# Altium schematic sheet PMS.SchDoc
size C
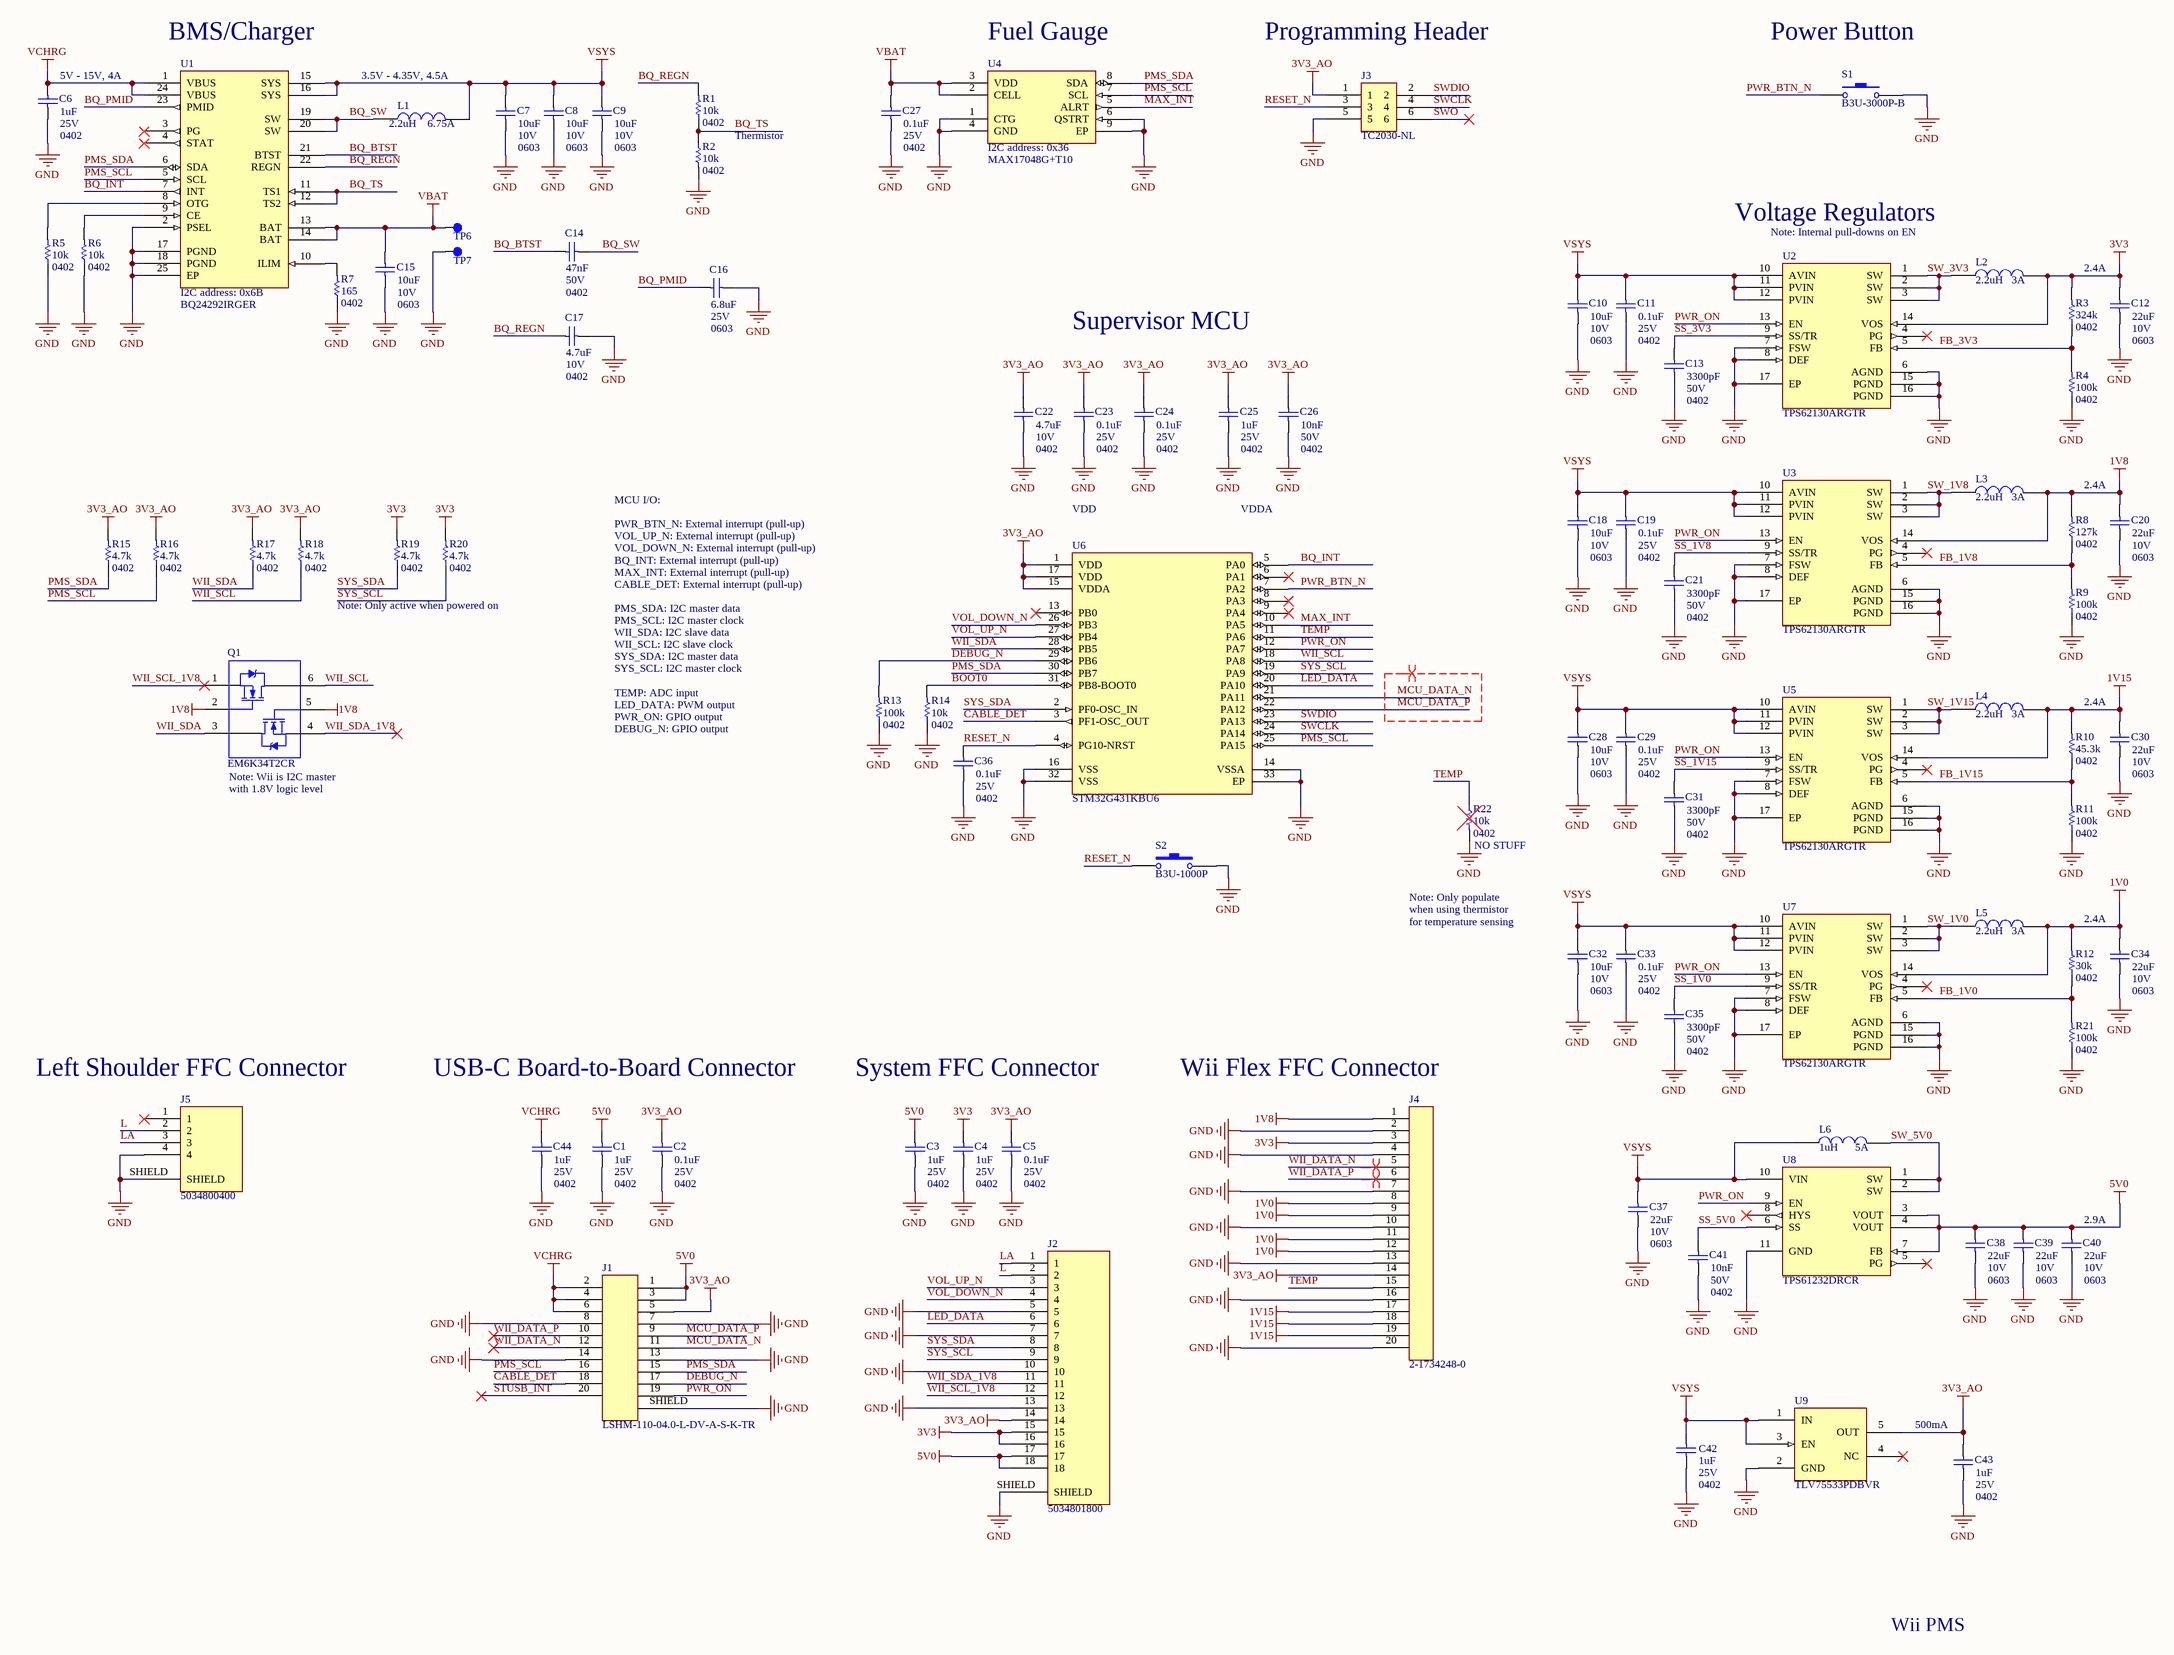
[diagram p0: PMS.SchDoc]

## Parts
C1  value 1uF  Rated Voltage: 25V  Package: 0402  [CAPC1005X06N]  (hidden comment: Capacitor)
C2  value 0.1uF  Rated Voltage: 25V  Package: 0402  [CAPC1005X06N]  (hidden comment: Capacitor)
C3  value 1uF  Rated Voltage: 25V  Package: 0402  [CAPC1005X06N]  (hidden comment: Capacitor)
C4  value 1uF  Rated Voltage: 25V  Package: 0402  [CAPC1005X06N]  (hidden comment: Capacitor)
C5  value 0.1uF  Rated Voltage: 25V  Package: 0402  [CAPC1005X06N]  (hidden comment: Capacitor)
C6  value 1uF  Rated Voltage: 25V  Package: 0402  [CAPC1005X06N]  (hidden comment: Capacitor)
C7  value 10uF  Rated Voltage: 10V  Package: 0603  [CAPC1608X09N]  (hidden comment: Capacitor)
C8  value 10uF  Rated Voltage: 10V  Package: 0603  [CAPC1608X09N]  (hidden comment: Capacitor)
C9  value 10uF  Rated Voltage: 10V  Package: 0603  [CAPC1608X09N]  (hidden comment: Capacitor)
C10  value 10uF  Rated Voltage: 10V  Package: 0603  [CAPC1608X09N]  (hidden comment: Capacitor)
C11  value 0.1uF  Rated Voltage: 25V  Package: 0402  [CAPC1005X06N]  (hidden comment: Capacitor)
C12  value 22uF  Rated Voltage: 10V  Package: 0603  [CAPC1608X09N]  (hidden comment: Capacitor)
C13  value 3300pF  Rated Voltage: 50V  Package: 0402  [CAPC1005X06N]  (hidden comment: Capacitor)
C14  value 47nF  Rated Voltage: 50V  Package: 0402  [CAPC1005X06N]  (hidden comment: Capacitor)
C15  value 10uF  Rated Voltage: 10V  Package: 0603  [CAPC1608X09N]  (hidden comment: Capacitor)
C16  value 6.8uF  Rated Voltage: 25V  Package: 0603  [CAPC1608X09N]  (hidden comment: Capacitor)
C17  value 4.7uF  Rated Voltage: 10V  Package: 0402  [CAPC1005X06N]  (hidden comment: Capacitor)
C18  value 10uF  Rated Voltage: 10V  Package: 0603  [CAPC1608X09N]  (hidden comment: Capacitor)
C19  value 0.1uF  Rated Voltage: 25V  Package: 0402  [CAPC1005X06N]  (hidden comment: Capacitor)
C20  value 22uF  Rated Voltage: 10V  Package: 0603  [CAPC1608X09N]  (hidden comment: Capacitor)
C21  value 3300pF  Rated Voltage: 50V  Package: 0402  [CAPC1005X06N]  (hidden comment: Capacitor)
C22  value 4.7uF  Rated Voltage: 10V  Package: 0402  [CAPC1005X06N]  (hidden comment: Capacitor)
C23  value 0.1uF  Rated Voltage: 25V  Package: 0402  [CAPC1005X06N]  (hidden comment: Capacitor)
C24  value 0.1uF  Rated Voltage: 25V  Package: 0402  [CAPC1005X06N]  (hidden comment: Capacitor)
C25  value 1uF  Rated Voltage: 25V  Package: 0402  [CAPC1005X06N]  (hidden comment: Capacitor)
C26  value 10nF  Rated Voltage: 50V  Package: 0402  [CAPC1005X06N]  (hidden comment: Capacitor)
C27  value 0.1uF  Rated Voltage: 25V  Package: 0402  [CAPC1005X06N]  (hidden comment: Capacitor)
C28  value 10uF  Rated Voltage: 10V  Package: 0603  [CAPC1608X09N]  (hidden comment: Capacitor)
C29  value 0.1uF  Rated Voltage: 25V  Package: 0402  [CAPC1005X06N]  (hidden comment: Capacitor)
C30  value 22uF  Rated Voltage: 10V  Package: 0603  [CAPC1608X09N]  (hidden comment: Capacitor)
C31  value 3300pF  Rated Voltage: 50V  Package: 0402  [CAPC1005X06N]  (hidden comment: Capacitor)
C32  value 10uF  Rated Voltage: 10V  Package: 0603  [CAPC1608X09N]  (hidden comment: Capacitor)
C33  value 0.1uF  Rated Voltage: 25V  Package: 0402  [CAPC1005X06N]  (hidden comment: Capacitor)
C34  value 22uF  Rated Voltage: 10V  Package: 0603  [CAPC1608X09N]  (hidden comment: Capacitor)
C35  value 3300pF  Rated Voltage: 50V  Package: 0402  [CAPC1005X06N]  (hidden comment: Capacitor)
C36  value 0.1uF  Rated Voltage: 25V  Package: 0402  [CAPC1005X06N]  (hidden comment: Capacitor)
C37  value 22uF  Rated Voltage: 10V  Package: 0603  [CAPC1608X09N]  (hidden comment: Capacitor)
C38  value 22uF  Rated Voltage: 10V  Package: 0603  [CAPC1608X09N]  (hidden comment: Capacitor)
C39  value 22uF  Rated Voltage: 10V  Package: 0603  [CAPC1608X09N]  (hidden comment: Capacitor)
C40  value 22uF  Rated Voltage: 10V  Package: 0603  [CAPC1608X09N]  (hidden comment: Capacitor)
C41  value 10nF  Rated Voltage: 50V  Package: 0402  [CAPC1005X06N]  (hidden comment: Capacitor)
C42  value 1uF  Rated Voltage: 25V  Package: 0402  [CAPC1005X06N]  (hidden comment: Capacitor)
C43  value 1uF  Rated Voltage: 25V  Package: 0402  [CAPC1005X06N]  (hidden comment: Capacitor)
C44  value 1uF  Rated Voltage: 25V  Package: 0402  [CAPC1005X06N]  (hidden comment: Capacitor)
J1  LSHM-110-04.0-L-DV-A-S-K-TR  [LSHM-110-04.0-L-DV-A-S]
J2  5034801800  [5034801800]
J3  TC2030-NL  [TC2030-NL]
J4  2-1734248-0  [2-1734248-0]
J5  5034800400  [5034800400]
L1  Current Rating: 6.75A  Inductance: 2.2uH  [INDM5252X30N]  (hidden comment: IHLP2020CZER2R2M11)
L2  Current Rating: 3A  Inductance: 2.2uH  [INDM3030X20N]  (hidden comment: IHLP1212BZER2R2M11)
L3  Current Rating: 3A  Inductance: 2.2uH  [INDM3030X20N]  (hidden comment: IHLP1212BZER2R2M11)
L4  Current Rating: 3A  Inductance: 2.2uH  [INDM3030X20N]  (hidden comment: IHLP1212BZER2R2M11)
L5  Current Rating: 3A  Inductance: 2.2uH  [INDM3030X20N]  (hidden comment: IHLP1212BZER2R2M11)
L6  Inductance: 1uH  Current Rating: 5A  [INDM3030X20N]  (hidden comment: IHLP1212BZER1R0M11)
Q1  EM6K34T2CR  [SOTFL50P160X50-6N]
R1  value 10k  Package: 0402  [RESC1005X04N]  (hidden comment: Resistor)
R2  value 10k  Package: 0402  [RESC1005X04N]  (hidden comment: Resistor)
R3  value 324k  Package: 0402  [RESC1005X04N]  (hidden comment: Resistor)
R4  value 100k  Package: 0402  [RESC1005X04N]  (hidden comment: Resistor)
R5  value 10k  Package: 0402  [RESC1005X04N]  (hidden comment: Resistor)
R6  value 10k  Package: 0402  [RESC1005X04N]  (hidden comment: Resistor)
R7  value 165  Package: 0402  [RESC1005X04N]  (hidden comment: Resistor)
R8  value 127k  Package: 0402  [RESC1005X04N]  (hidden comment: Resistor)
R9  value 100k  Package: 0402  [RESC1005X04N]  (hidden comment: Resistor)
R10  value 45.3k  Package: 0402  [RESC1005X04N]  (hidden comment: Resistor)
R11  value 100k  Package: 0402  [RESC1005X04N]  (hidden comment: Resistor)
R12  value 30k  Package: 0402  [RESC1005X04N]  (hidden comment: Resistor)
R13  value 100k  Package: 0402  [RESC1005X04N]  (hidden comment: Resistor)
R14  value 10k  Package: 0402  [RESC1005X04N]  (hidden comment: Resistor)
R15  value 4.7k  Package: 0402  [RESC1005X04N]  (hidden comment: Resistor)
R16  value 4.7k  Package: 0402  [RESC1005X04N]  (hidden comment: Resistor)
R17  value 4.7k  Package: 0402  [RESC1005X04N]  (hidden comment: Resistor)
R18  value 4.7k  Package: 0402  [RESC1005X04N]  (hidden comment: Resistor)
R19  value 4.7k  Package: 0402  [RESC1005X04N]  (hidden comment: Resistor)
R20  value 4.7k  Package: 0402  [RESC1005X04N]  (hidden comment: Resistor)
R21  value 100k  Package: 0402  [RESC1005X04N]  (hidden comment: Resistor)
R22  value 10k  Package: 0402  Note: NO STUFF  [RESC1005X04N]  (hidden comment: Resistor)
S1  B3U-3000P-B  [B3U-3000P-B]
S2  B3U-1000P  [B3U-1000P]
TP6  Test Point  [TP_RECTANGULAR_1.5X2MM]  (value not drawn)
TP7  Test Point  [TP_RECTANGULAR_1.5X2MM]  (value not drawn)
U1  BQ24292IRGER  [QFN50P400X400X100_HS-25N]
U2  TPS62130ARGTR  [QFN50P300X300X100_HS-17N]
U3  TPS62130ARGTR  [QFN50P300X300X100_HS-17N]
U4  MAX17048G+T10  [SON50P200X80_HS-9N]
U5  TPS62130ARGTR  [QFN50P300X300X100_HS-17N]
U6  STM32G431KBU6  [QFN50P500X500X60_HS-33N]
U7  TPS62130ARGTR  [QFN50P300X300X100_HS-17N]
U8  TPS61232DRCR  [SON50P300X100_HS-11N]
U9  TLV75533PDBVR  [SOT95P280X145-5N]

## Nets
1V0: C34.2 J4.8 J4.9 J4.11 J4.12 L5.2 R12.2 U7.14(VOS)
1V8: C20.2 J4.1 L3.2 Q1.2(G1) Q1.5(G2) R8.2 U3.14(VOS)
1V15: C30.2 J4.17 J4.18 J4.19 L4.2 R10.2 U5.14(VOS)
3V3: C4.2 C12.2 J2.15 J2.16 J4.3 L2.2 R3.2 R19.2 R20.2 U2.14(VOS)
3V3_AO: C2.2 C5.2 C22.2 C23.2 C24.2 C25.2 C26.2 C43.2 J1.5 J2.14 J3.1 J4.14 R15.2 R16.2 R17.2 R18.2 U6.1(VDD) U6.15(VDDA) U6.17(VDD) U9.5(OUT)
5V0: C1.2 C3.2 C38.2 C39.2 C40.2 J1.1 J1.3 J2.17 J2.18 U8.3(VOUT) U8.4(VOUT) U8.7(FB)
GND: C1.1 C2.1 C3.1 C4.1 C5.1 C6.1 C7.1 C8.1 C9.1 C10.1 C11.1 C12.1 C13.1 C15.1 C16.2 C17.2 C18.1 C19.1 C20.1 C21.1 C22.1 C23.1 C24.1 C25.1 C26.1 C27.1 C28.1 C29.1 C30.1 C31.1 C32.1 C33.1 C34.1 C35.1 C36.1 C37.1 C38.1 C39.1 C40.1 C41.1 C42.1 C43.1 C44.1 J1.7 J1.8 J1.13 J1.14 J1.SHIELD J2.5 J2.7 J2.10 J2.13 J2.SHIELD J3.5 J4.2 J4.4 J4.7 J4.10 J4.13 J4.16 J4.20 J5.4 J5.SHIELD R2.2 R4.1 R5.1 R6.1 R7.1 R9.1 R11.1 R13.1 R14.1 R21.1 R22.2 S1.1 S2.2 TP7.1 U1.2(PSEL) U1.17(PGND) U1.18(PGND) U1.25(EP) U2.6(AGND) U2.7(FSW) U2.8(DEF) U2.15(PGND) U2.16(PGND) U2.17(EP) U3.6(AGND) U3.7(FSW) U3.8(DEF) U3.15(PGND) U3.16(PGND) U3.17(EP) U4.1(CTG) U4.4(GND) U4.6(QSTRT) U4.9(EP) U5.6(AGND) U5.7(FSW) U5.8(DEF) U5.15(PGND) U5.16(PGND) U5.17(EP) U6.14(VSSA) U6.16(VSS) U6.32(VSS) U6.33(EP) U7.6(AGND) U7.7(FSW) U7.8(DEF) U7.15(PGND) U7.16(PGND) U7.17(EP) U8.11(GND) U9.2(GND)
VBAT: C15.2 C27.2 TP6.1 U1.13(BAT) U1.14(BAT) U4.2(CELL) U4.3(VDD)
VCHRG: C6.2 C44.2 J1.2 J1.4 J1.6 U1.1(VBUS) U1.24(VBUS)
VSYS: C7.2 C8.2 C9.2 C10.2 C11.2 C18.2 C19.2 C28.2 C29.2 C32.2 C33.2 C37.2 C42.2 L1.2 L6.1 U1.15(SYS) U1.16(SYS) U2.10(AVIN) U2.11(PVIN) U2.12(PVIN) U3.10(AVIN) U3.11(PVIN) U3.12(PVIN) U5.10(AVIN) U5.11(PVIN) U5.12(PVIN) U7.10(AVIN) U7.11(PVIN) U7.12(PVIN) U8.10(VIN) U9.1(IN) U9.3(EN)
BOOT0: R14.2 U6.31(PB8-BOOT0)
BQ_BTST: C14.1 U1.21(BTST)
BQ_INT: U1.7(INT) U6.5(PA0)
BQ_PMID: C16.1 U1.23(PMID)
BQ_REGN: C17.1 R1.2 U1.22(REGN)
BQ_SW: C14.2 L1.1 U1.19(SW) U1.20(SW)
BQ_TS: R1.1 R2.1 U1.11(TS1) U1.12(TS2)
CABLE_DET: J1.18 U6.3(PF1-OSC_OUT)
DEBUG_N: J1.17 R13.2 U6.29(PB6)
FB_1V0: R12.1 R21.2 U7.5(FB)
FB_1V8: R8.1 R9.2 U3.5(FB)
FB_1V15: R10.1 R11.2 U5.5(FB)
FB_3V3: R3.1 R4.2 U2.5(FB)
L: J2.2 J5.2
LA: J2.1 J5.3
LED_DATA: J2.6 U6.20(PA10)
MAX_INT: U4.5(ALRT) U6.10(PA5)
MCU_DATA_N: J1.11 U6.21(PA11)
MCU_DATA_P: J1.9 U6.22(PA12)
PMS_SCL: J1.16 R16.1 U1.5(SCL) U4.7(SCL) U6.25(PA15)
PMS_SDA: J1.15 R15.1 U1.6(SDA) U4.8(SDA) U6.30(PB7)
PWR_BTN_N: S1.2 U6.7(PA2)
PWR_ON: J1.19 U2.13(EN) U3.13(EN) U5.13(EN) U6.12(PA7) U7.13(EN) U8.9(EN)
RESET_N: C36.2 J3.3 S2.1 U6.4(PG10-NRST)
SS_1V0: C35.2 U7.9(SS/TR)
SS_1V8: C21.2 U3.9(SS/TR)
SS_1V15: C31.2 U5.9(SS/TR)
SS_3V3: C13.2 U2.9(SS/TR)
SS_5V0: C41.2 U8.6(SS)
STUSB_INT: J1.20
SW_1V0: L5.1 U7.1(SW) U7.2(SW) U7.3(SW)
SW_1V8: L3.1 U3.1(SW) U3.2(SW) U3.3(SW)
SW_1V15: L4.1 U5.1(SW) U5.2(SW) U5.3(SW)
SW_3V3: L2.1 U2.1(SW) U2.2(SW) U2.3(SW)
SW_5V0: L6.2 U8.1(SW) U8.2(SW)
SWCLK: J3.4 U6.24(PA14)
SWDIO: J3.2 U6.23(PA13)
SWO: J3.6
SYS_SCL: J2.9 R20.1 U6.19(PA9)
SYS_SDA: J2.8 R19.1 U6.2(PF0-OSC_IN)
TEMP: J4.15 R22.1 U6.11(PA6)
VOL_DOWN_N: J2.4 U6.26(PB3)
VOL_UP_N: J2.3 U6.27(PB4)
WII_DATA_N: J1.12 J4.5
WII_DATA_P: J1.10 J4.6
WII_SCL: Q1.6(D1) R18.1 U6.18(PA8)
WII_SCL_1V8: J2.12 Q1.1(S1)
WII_SDA: Q1.3(D2) R17.1 U6.28(PB5)
WII_SDA_1V8: J2.11 Q1.4(S2)
NetR5_2: R5.2 U1.8(OTG)
NetR6_2: R6.2 U1.9(CE)
NetR7_2: R7.2 U1.10(ILIM)

Not connected (* = marked no-connect by the designer): J5 1*; U1 3(PG)* 4(STAT)*; U2 4(PG)*; U3 4(PG)*; U5 4(PG)*; U6 6(PA1)* 8(PA3)* 9(PA4)* 13(PB0)*; U7 4(PG)*; U8 5(PG)* 8(HYS)*; U9 4(NC)*

## Layout directives
differential pair: MCU_DATA_N, MCU_DATA_P, WII_DATA_N, WII_DATA_P

## Notes on the sheet
- (near C6) 5V - 15V, 4A
- (near U1) BMS/Charger
- 3.5V - 4.35V, 4.5A
- (near U4) Fuel Gauge
- Programming Header
- Power Button
- Thermistor
- Voltage Regulators
- Note: Internal pull-downs on EN
- 2.4A
- Supervisor MCU
- VDD
- VDDA
- Note: Only active when powered on
- MCU I/O:
  PWR_BTN_N: External interrupt (pull-up)
  VOL_UP_N: External interrupt (pull-up)
  VOL_DOWN_N: External interrupt (pull-up)
  BQ_INT: External interrupt (pull-up)
  MAX_INT: External interrupt (pull-up)
  CABLE_DET: External interrupt (pull-up)
  PMS_SDA: I2C master data
  PMS_SCL: I2C master clock
  WII_SDA: I2C slave data
  WII_SCL: I2C slave clock
  SYS_SDA: I2C master data
  SYS_SCL: I2C master clock
  TEMP: ADC input
  LED_DATA: PWM output
  PWR_ON: GPIO output
  DEBUG_N: GPIO output
- (near Q1) Note: Wii is I2C master with 1.8V logic level
- Note: Only populate when using thermistor for temperature sensing
- (near J5) Left Shoulder FFC Connector
- USB-C Board-to-Board Connector
- System FFC Connector
- (near J4) Wii Flex FFC Connector
- (near C40) 2.9A
- 500mA
- Wii PMS
- (in symbol BQ24292IRGER) I2C address: 0x6B
- (in symbol MAX17048G+T10) I2C address: 0x36

## Library data of the parts
C1-C44 = Capacitor: General purpose capacitor
J1 = LSHM-110-04.0-L-DV-A-S-K-TR: HERMAPHRODITIC 0.50MM SMD 20POS 4MM; Manufacturer: Samtec; Supplier 1: Digi-Key; Manufacturer Part Number: LSHM-110-04.0-L-DV-A-S-K-TR; RoHS: No; Pricing 1: 625=3.77400 (USD)
J2 = 5034801800: CONN FFC FPC 18POS 0.50MM R/A; Manufacturer: Molex; Actuator Material: Nylon,Glass,Polyamide; Number of Positions: 18; Max Voltage Rating (AC): 50V; Current Rating: 500mA; Mating Cycles: 10; Stackable: No; Contact Location: Dual; Gender: Receptacle; Wire/Cable Type: Straight; Pitch: 0.5mm; Supplier 1: Digi-Key; Manufacturer Part Number: 5034801800; RoHS: Yes; Category: FFC / FPC; Stock 1: 15433; Pricing 1: 1=1.44000, 10=1.31000, 25=1.23000, 50=1.17660, 100=1.12310, 250=1.01616, 500=0.93594, 1000=0.80223 (USD); Housing Material: Polymer; Contact Material: Bronze,Gold; Housing Color: White; Contact Plating: Gold,Tin; Material: Bronze; Min Operating Temperature: -40°C; Max Operating Temperature: 85°C; Packaging: Tape and Reel; Termination: SMD/SMT; Number of Contacts: 18; Orientation: Right Angle; Number of Rows: 1; Package Quantity: 3000; Voltage Rating: 50V; Number of Circuits: 18; Voltage Rating (AC): 50V; Length: 10.7mm; Depth: 4mm; Radiation Hardening: No; Flammability Rating: UL94 V-0; REACH SVHC: Unknown; Halogen Free: Low Halogen; ELV: Compliant; ComponentLink1URL: https://datasheet.ciiva.com/671/5034800400-sd-671136.pdf?src-supplier=Digi-Key; ComponentLink1Description: https://datasheet.ciiva.com/671/5034800400-sd-671136.pdf?src-supplier=Digi-Key; ComponentLink2URL: https://datasheet.ciiva.com/5137/5034801800-ffc-fpc-connectors-179548-5137672.pdf?src-supplier=Mouser; ComponentLink2Description: https://datasheet.ciiva.com/5137/5034801800-ffc-fpc-connectors-179548-5137672.pdf?src-supplier=Mouser; ComponentLink3URL: https://datasheet.ciiva.com/10366/5034801800-ffc-fpc-connectors-10366583.pdf?src-supplier=Avnet; ComponentLink3Description: https://datasheet.ciiva.com/10366/5034801800-ffc-fpc-connectors-10366583.pdf?src-supplier=Avnet
J3 = TC2030-NL: 6-Pin No-Legs Tag-Connect Plug-of-Nails™ Cable with Ribbon Connector
J4 = 2-1734248-0: FFC/FPC CONNECTOR, RECEPTACLE 20POS 1ROW; Manufacturer: TE Connectivity; Number of Contacts: 20; Contact Current Rating: 1A; Contact Location: Bottom; Connector Type: Receptacle,Connector,Socket; Wire/Cable Type: Flat Flex; Connector System: Flex-to-Board; Mating Alignment: Yes (With); PCB Mount Alignment: No (Without); PCB Mount Retention: With; PCB Mounting Orientation: Vertical; Gender: Male; Voltage Rating: 125V; Shielding: Unshielded; Pitch: 0.039inch; Supplier 1: Digi-Key; Manufacturer Part Number: 2-1734248-0; RoHS: Yes; Category: FFC / FPC; Stock 1: 651; Pricing 1: 1=1.62000, 10=1.47400, 25=1.38360, 50=1.32340, 100=1.26330, 250=1.14300, 500=1.05274 (USD); Mount: Surface Mount; Housing Color: Black; Housing Material: Thermoplastic; Contact Plating: Gold; Contact Material: Bronze; Min Operating Temperature: -4°C; Max Operating Temperature: 185°C; Termination: SMD/SMT; Orientation: Straight; Number of Rows: 1; Number of Positions: 20; Sealable: No (Without); Shrouded: Yes (With); Current Rating: 1A; Package Quantity: 1000; Packaging: Tape and Reel; Length: 27.4mm; Height: 7.7mm; Depth: 4.6mm; Width: 4.6mm; Radiation Hardening: No; REACH SVHC: Unknown; Flammability Rating: UL94 V-0; ELV: Compliant; Lead Free: Lead Free; ComponentLink1URL: https://datasheet.ciiva.com/1446/1652249-1446928.pdf?src-supplier=Farnell; ComponentLink1Description: https://datasheet.ciiva.com/1446/1652249-1446928.pdf?src-supplier=Farnell; ComponentLink2URL: https://datasheet.ciiva.com/43513/eng-ds-1-1773440-6-0506-43513462.pdf?src-supplier=Onlinecomponents.com; ComponentLink2Description: https://datasheet.ciiva.com/43513/eng-ds-1-1773440-6-0506-43513462.pdf?src-supplier=Onlinecomponents.com; ComponentLink3URL: https://datasheet.ciiva.com/669/eng-cd-1734248-e1-669771.pdf?src-supplier=Digi-Key; ComponentLink3Description: https://datasheet.ciiva.com/669/eng-cd-1734248-e1-669771.pdf?src-supplier=Digi-Key; ComponentLink4URL: https://datasheet.ciiva.com/669/eng-cd-1734248-e1-669772.pdf?src-supplier=Digi-Key; ComponentLink4Description: https://datasheet.ciiva.com/669/eng-cd-1734248-e1-669772.pdf?src-supplier=Digi-Key; ComponentLink5URL: https://datasheet.ciiva.com/669/eng-cd-1734248-e1-669773.pdf?src-supplier=Digi-Key; ComponentLink5Description: https://datasheet.ciiva.com/669/eng-cd-1734248-e1-669773.pdf?src-supplier=Digi-Key; ComponentLink6URL: https://datasheet.ciiva.com/1437/586796-1437710.pdf?src-supplier=Element14; ComponentLink6Description: https://datasheet.ciiva.com/1437/586796-1437710.pdf?src-supplier=Element14
J5 = 5034800400: CONN FFC FPC 4POS 0.50MM R/A; Manufacturer: Molex; Actuator Material: Nylon,Glass,Polyamide; Current Rating: 500mA; Voltage Rating: 50V; Wire/Cable Type: Straight; Number of Positions: 4; Mating Cycles: 10; Stackable: No; Gender: Female; Pitch: 0.5mm; Supplier 1: Digi-Key; Manufacturer Part Number: 5034800400; RoHS: Yes; Category: FFC / FPC; Stock 1: 13432; Pricing 1: 1=0.70000, 10=0.65200, 25=0.58640, 50=0.52140, 100=0.49970, 250=0.45624, 500=0.43450, 1000=0.35846 (USD); Contact Material: Bronze; Contact Plating: Gold; Housing Color: White; Housing Material: Polymer; Material: Bronze; Min Operating Temperature: -40°C; Max Operating Temperature: 85°C; Number of Rows: 1; Orientation: Right Angle; Termination: Solder; Package Quantity: 1; Packaging: Tape and Reel; Max Voltage Rating (AC): 50V; Number of Contacts: 4; Max Voltage Rating (DC): 50V; Number of Circuits: 4; Voltage Rating (AC): 50V; Length: 3.7mm; Depth: 4mm; Radiation Hardening: No; Flammability Rating: UL94 V-0; REACH SVHC: No SVHC; Halogen Free: Low Halogen; ELV: Compliant; ComponentLink1URL: https://datasheet.ciiva.com/671/5034800400-sd-671136.pdf?src-supplier=Digi-Key; ComponentLink1Description: https://datasheet.ciiva.com/671/5034800400-sd-671136.pdf?src-supplier=Digi-Key; ComponentLink2URL: https://datasheet.ciiva.com/15249/392825034800400-ffc-fpc-nectors-15249120.pdf?src-supplier=Arrow+Europe; ComponentLink2Description: https://datasheet.ciiva.com/15249/392825034800400-ffc-fpc-nectors-15249120.pdf?src-supplier=Arrow+Europe; ComponentLink3URL: https://datasheet.ciiva.com/16658/5034800400-ffc-fpc-connectors-16658883.pdf?src-supplier=Avnet+Europe; ComponentLink3Description: https://datasheet.ciiva.com/16658/5034800400-ffc-fpc-connectors-16658883.pdf?src-supplier=Avnet+Europe; ComponentLink4URL: https://datasheet.ciiva.com/3926/135095034800400-ffc-fpc-nectors-3926214.pdf?src-supplier=Arrow; ComponentLink4Description: https://datasheet.ciiva.com/3926/135095034800400-ffc-fpc-nectors-3926214.pdf?src-supplier=Arrow; ComponentLink5URL: https://datasheet.ciiva.com/5137/5034800400-ffc-fpc-connectors-179546-5137607.pdf?src-supplier=Mouser; ComponentLink5Description: https://datasheet.ciiva.com/5137/5034800400-ffc-fpc-connectors-179546-5137607.pdf?src-supplier=Mouser; ComponentLink6URL: https://datasheet.ciiva.com/671/5034800400-sd-671137.pdf?src-supplier=Digi-Key; ComponentLink6Description: https://datasheet.ciiva.com/671/5034800400-sd-671137.pdf?src-supplier=Digi-Key; ComponentLink7URL: https://datasheet.ciiva.com/671/5034800400-sd-671138.pdf?src-supplier=Digi-Key; ComponentLink7Description: https://datasheet.ciiva.com/671/5034800400-sd-671138.pdf?src-supplier=Digi-Key; ComponentLink8URL: https://datasheet.ciiva.com/10366/5034800400-ffc-fpc-connectors-10366566.pdf?src-supplier=Avnet; ComponentLink8Description: https://datasheet.ciiva.com/10366/5034800400-ffc-fpc-connectors-10366566.pdf?src-supplier=Avnet
L1 = IHLP2020CZER2R2M11: FIXED IND 2.2UH 6.75A 25 MOHM; Manufacturer: Vishay Dale; Core Material: Metal,Composite; Tolerance: 20%; DC Resistance (DCR): 25mR; Saturation Current: 5.5A; Shielding: Shielded; Self Resonant Frequency: 41MHz; Test Frequency: 100kHz; Supplier 1: Digi-Key; Manufacturer Part Number: IHLP2020CZER2R2M11; RoHS: Yes; Category: Fixed Inductors; Stock 1: 58349; Pricing 1: 1=2.39000, 10=2.20800, 100=1.54560, 500=1.25120, 1000=1.14080 (USD); Mount: Surface Mount; Case/Package: 2020; Contact Plating: Tin; Min Operating Temperature: -55°C; Max Operating Temperature: 125°C; Packaging: Tape and Reel; Inductance Tolerance: 20%; Package Quantity: 2000; Max DC Current: 5.5A; Termination: SMD/SMT; RMS Current (Irms): 6.75A; Military Standard: Not; Length: 5.74mm; Height: 3mm; Depth: 5.43mm; Width: 0.204inch; Height - Seated (Max): 0.118inch; Radiation Hardening: No; Lead Free: Lead Free; REACH SVHC: Unknown; ComponentLink1URL: https://datasheet.ciiva.com/11798/0900766b8102c930-11798352.pdf?src-supplier=RSComponents; ComponentLink1Description: https://datasheet.ciiva.com/11798/0900766b8102c930-11798352.pdf?src-supplier=RSComponents; ComponentLink2URL: https://datasheet.ciiva.com/1051/lp20cz11-1051642.pdf?src-supplier=Digi-Key; ComponentLink2Description: https://datasheet.ciiva.com/1051/lp20cz11-1051642.pdf?src-supplier=Digi-Key; ComponentLink3URL: https://datasheet.ciiva.com/1051/lp20cz11-1051643.pdf?src-supplier=Digi-Key; ComponentLink3Description: https://datasheet.ciiva.com/1051/lp20cz11-1051643.pdf?src-supplier=Digi-Key; ComponentLink4URL: https://datasheet.ciiva.com/17269/lp20cz11-17269547.pdf?src-supplier=Avnet+Europe; ComponentLink4Description: https://datasheet.ciiva.com/17269/lp20cz11-17269547.pdf?src-supplier=Avnet+Europe; ComponentLink5URL: https://datasheet.ciiva.com/1051/lp20cz11-1051644.pdf?src-supplier=Digi-Key; ComponentLink5Description: https://datasheet.ciiva.com/1051/lp20cz11-1051644.pdf?src-supplier=Digi-Key; ComponentLink6URL: https://datasheet.ciiva.com/24205/lp20cz11-24205966.pdf?src-supplier=Future+Electronics; ComponentLink6Description: https://datasheet.ciiva.com/24205/lp20cz11-24205966.pdf?src-supplier=Future+Electronics; ComponentLink7URL: https://datasheet.ciiva.com/46385/480942-46385615.pdf?src-supplier=Element14; ComponentLink7Description: https://datasheet.ciiva.com/46385/480942-46385615.pdf?src-supplier=Element14
L2-L5 = IHLP1212BZER2R2M11: FIXED IND 2.2UH 3A 46 MOHM SMD; Manufacturer: Vishay Dale; Core Material: Metal,Composite,Ferrite; Tolerance: 20%; DC Resistance (DCR): 46mR; Self Resonant Frequency: 55MHz; Shielding: Shielded; Saturation Current: 3.3A; Test Frequency: 100kHz; Supplier 1: Digi-Key; Manufacturer Part Number: IHLP1212BZER2R2M11; RoHS: Yes; Category: Fixed Inductors; Stock 1: 1430; Pricing 1: 1=1.45000, 10=1.34600, 100=0.97290, 500=0.74520, 1000=0.66240 (USD); Mount: Surface Mount; Case/Package: 1212; Number of Pins: 2; Contact Plating: Tin; Min Operating Temperature: -55°C; Max Operating Temperature: 125°C; Packaging: Tape and Reel; Inductance Tolerance: 20%; Package Quantity: 3000; Max DC Current: 3A; Termination: SMD/SMT; RMS Current (Irms): 3A; Military Standard: Not; Length: 3.6mm; Height: 2mm; Depth: 3.2mm; Width: 3mm; Height - Seated (Max): 0.079inch; Radiation Hardening: No; REACH SVHC: Unknown; Lead Free: Lead Free; ComponentLink1URL: https://datasheet.ciiva.com/7290/1537140-7290128.pdf?src-supplier=Newark; ComponentLink1Description: https://datasheet.ciiva.com/7290/1537140-7290128.pdf?src-supplier=Newark; ComponentLink2URL: https://datasheet.ciiva.com/8017/1520470-8017625.pdf?src-supplier=Element14; ComponentLink2Description: https://datasheet.ciiva.com/8017/1520470-8017625.pdf?src-supplier=Element14; ComponentLink3URL: https://datasheet.ciiva.com/11798/0900766b8102b422-11798283.pdf?src-supplier=RSComponents; ComponentLink3Description: https://datasheet.ciiva.com/11798/0900766b8102b422-11798283.pdf?src-supplier=RSComponents; ComponentLink4URL: https://datasheet.ciiva.com/3866/lp12bz11-3866206.pdf?src-supplier=Arrow; ComponentLink4Description: https://datasheet.ciiva.com/3866/lp12bz11-3866206.pdf?src-supplier=Arrow; ComponentLink5URL: https://datasheet.ciiva.com/16335/lp12bz11-16335797.pdf?src-supplier=Future+Electronics; ComponentLink5Description: https://datasheet.ciiva.com/16335/lp12bz11-16335797.pdf?src-supplier=Future+Electronics; ComponentLink6URL: https://datasheet.ciiva.com/4953/lp12bz11-244380-4953990.pdf?src-supplier=Mouser; ComponentLink6Description: https://datasheet.ciiva.com/4953/lp12bz11-244380-4953990.pdf?src-supplier=Mouser; ComponentLink7URL: https://datasheet.ciiva.com/6688/lp12bz11-6688247.pdf?src-supplier=Digi-Key; ComponentLink7Description: https://datasheet.ciiva.com/6688/lp12bz11-6688247.pdf?src-supplier=Digi-Key; ComponentLink8URL: https://datasheet.ciiva.com/6688/lp12bz11-6688250.pdf?src-supplier=Digi-Key; ComponentLink8Description: https://datasheet.ciiva.com/6688/lp12bz11-6688250.pdf?src-supplier=Digi-Key; ComponentLink9URL: https://datasheet.ciiva.com/6688/lp12bz11-6688252.pdf?src-supplier=Digi-Key; ComponentLink9Description: https://datasheet.ciiva.com/6688/lp12bz11-6688252.pdf?src-supplier=Digi-Key; ComponentLink10URL: https://datasheet.ciiva.com/3081/lp12bz11-3081917.pdf?src-supplier=Avnet; ComponentLink10Description: https://datasheet.ciiva.com/3081/lp12bz11-3081917.pdf?src-supplier=Avnet; ComponentLink11URL: https://datasheet.ciiva.com/17268/lp12bz11-17268765.pdf?src-supplier=Avnet+Europe; ComponentLink11Description: https://datasheet.ciiva.com/17268/lp12bz11-17268765.pdf?src-supplier=Avnet+Europe
L6 = IHLP1212BZER1R0M11: FIXED IND 1UH 5A 24 MOHM SMD; Manufacturer: Vishay Dale; Core Material: Metal,Composite; Tolerance: 20%; DC Resistance (DCR): 24mR; Self Resonant Frequency: 75MHz; Shielding: Shielded; Saturation Current: 4.5A; Test Frequency: 100kHz; Supplier 1: Digi-Key; Manufacturer Part Number: IHLP1212BZER1R0M11; RoHS: Yes; Category: Fixed Inductors; Stock 1: 94740; Pricing 1: 1=1.45000, 10=1.34600, 100=0.97290, 500=0.74520, 1000=0.66240 (USD); Mount: Surface Mount; Case/Package: 1212; Number of Pins: 2; Case Code (Imperial): 1212; Contact Plating: Tin; Case Code (Metric): 3630; Min Operating Temperature: -55°C; Max Operating Temperature: 125°C; Packaging: Tape and Reel; Package Quantity: 3000; Inductance Tolerance: 20%; Max DC Current: 5A; Termination: SMD/SMT; RMS Current (Irms): 5A; Military Standard: Not; Length: 3.6mm; Height: 2mm; Depth: 3.2mm; Width: 0.118inch; Height - Seated (Max): 0.079inch; Radiation Hardening: No; REACH SVHC: Unknown; Lead Free: Lead Free; ComponentLink1URL: https://datasheet.ciiva.com/11798/0900766b8102b422-11798284.pdf?src-supplier=RSComponents; ComponentLink1Description: https://datasheet.ciiva.com/11798/0900766b8102b422-11798284.pdf?src-supplier=RSComponents; ComponentLink2URL: https://datasheet.ciiva.com/26821/getdatasheetpartid-180380-26821417.pdf?src-supplier=Verical; ComponentLink2Description: https://datasheet.ciiva.com/26821/getdatasheetpartid-180380-26821417.pdf?src-supplier=Verical; ComponentLink3URL: https://datasheet.ciiva.com/6688/lp12bz11-6688261.pdf?src-supplier=Digi-Key; ComponentLink3Description: https://datasheet.ciiva.com/6688/lp12bz11-6688261.pdf?src-supplier=Digi-Key; ComponentLink4URL: https://datasheet.ciiva.com/6688/lp12bz11-6688263.pdf?src-supplier=Digi-Key; ComponentLink4Description: https://datasheet.ciiva.com/6688/lp12bz11-6688263.pdf?src-supplier=Digi-Key; ComponentLink5URL: https://datasheet.ciiva.com/8017/652599-8017624.pdf?src-supplier=Element14; ComponentLink5Description: https://datasheet.ciiva.com/8017/652599-8017624.pdf?src-supplier=Element14; ComponentLink6URL: https://datasheet.ciiva.com/17268/lp12bz11-17268761.pdf?src-supplier=Avnet+Europe; ComponentLink6Description: https://datasheet.ciiva.com/17268/lp12bz11-17268761.pdf?src-supplier=Avnet+Europe; ComponentLink7URL: https://datasheet.ciiva.com/6688/lp12bz11-6688255.pdf?src-supplier=Digi-Key; ComponentLink7Description: https://datasheet.ciiva.com/6688/lp12bz11-6688255.pdf?src-supplier=Digi-Key; ComponentLink8URL: https://datasheet.ciiva.com/4957/lp12bz11-244380-4957957.pdf?src-supplier=Mouser; ComponentLink8Description: https://datasheet.ciiva.com/4957/lp12bz11-244380-4957957.pdf?src-supplier=Mouser; ComponentLink9URL: https://datasheet.ciiva.com/3081/lp12bz11-3081912.pdf?src-supplier=Avnet; ComponentLink9Description: https://datasheet.ciiva.com/3081/lp12bz11-3081912.pdf?src-supplier=Avnet
Q1 = EM6K34T2CR: MOSFET 2N-CH 50V 0.2A EMT6; Manufacturer: Rohm; FET Type: 2 N-Channel; Continuous Drain Current (ID): 200mA; Rds On Max: 2.2R; Input Capacitance: 26pF; Max Power Dissipation: 120mW; Supplier 1: Digi-Key; Manufacturer Part Number: EM6K34T2CR; RoHS: Yes; Category: MOSFETs; Stock 1: 17851; Pricing 1: 1=0.35000, 10=0.26400, 25=0.23120, 100=0.12540, 250=0.12476, 500=0.10230, 1000=0.07590, 2500=0.06666 (USD); Mount: Surface Mount; Packaging: Tape and Reel; Drain to Source Voltage (Vdss): 50V; Lead Free: Lead Free; ComponentLink1URL: http://www.mouser.com/ds/2/348/em6k34-515126.pdf?src-supplier=Mouser; ComponentLink1Description: http://www.mouser.com/ds/2/348/em6k34-515126.pdf?src-supplier=Mouser; ComponentLink2URL: http://www.farnell.com/datasheets/2197909.pdf?src-supplier=Farnell; ComponentLink2Description: http://www.farnell.com/datasheets/2197909.pdf?src-supplier=Farnell; ComponentLink3URL: http://rohmfs.rohm.com/en/products/databook/datasheet/discrete/transistor/mosfet/em6k34.pdf?src-supplier=Digi-Key; ComponentLink3Description: http://rohmfs.rohm.com/en/products/databook/datasheet/discrete/transistor/mosfet/em6k34.pdf?src-supplier=Digi-Key; ComponentLink4URL: http://rohmfs.rohm.com/en/products/databook/datasheet/discrete/transistor/mosfet/em6k34.pdf?src-supplier=Avnet; ComponentLink4Description: http://rohmfs.rohm.com/en/products/databook/datasheet/discrete/transistor/mosfet/em6k34.pdf?src-supplier=Avnet; ComponentLink5URL: http://rohmfs.rohm.com/en/techdata_basic/transistor/taping/EMT6_T2R_taping.pdf?src-supplier=Digi-Key; ComponentLink5Description: http://rohmfs.rohm.com/en/techdata_basic/transistor/taping/EMT6_T2R_taping.pdf?src-supplier=Digi-Key; ComponentLink6URL: http://www.farnell.com/datasheets/2197909.pdf?src-supplier=Newark; ComponentLink6Description: http://www.farnell.com/datasheets/2197909.pdf?src-supplier=Newark
R1-R22 = Resistor: General purpose resistor
S1 = B3U-3000P-B: Switch Tactile N.O. SPST Button Gull Wing 0.05A 12VDC 1.59N SMD Embossed T/R; Manufacturer: Omron; Mechanical Life: 100000Cycles; Illumination Type: Non-Illuminated,Illuminated; Insulation Resistance: 100MR; Contact Current Rating: 50mA; Voltage Rating (DC): 12V; Switch Travel: 0.2mm; Switch Function: Off-Mom; Actuator Length: 0.7mm; Ratings: Dust Proof; Supplier 1: Digi-Key; Manufacturer Part Number: B3U-3000P-B; RoHS: Yes; Category: Tactile Switches; Stock 1: 25144; Pricing 1: 1=0.98000, 10=0.94300, 25=0.88120, 100=0.76500, 250=0.69612, 500=0.64536, 1000=0.59822 (USD); Mount: Surface Mount; Weight: 0.000776oz; Min Operating Temperature: -25°C; Max Operating Temperature: 70°C; Termination: SMD/SMT; Electrical Life: 100000Cycles; Max Current Rating: 50mA; Operating Force: 1.59N; Packaging: Tape and Reel; Throw Configuration: SPST; Contact Resistance: 100mR; Package Quantity: 1; Current Rating: 50mA; Max Voltage Rating (DC): 12V; Orientation: Right Angle; Length: 4mm; Height: 1.2mm; Depth: 3.2mm; Width: 3mm; Radiation Hardening: No; REACH SVHC: No SVHC; Lead Free: Lead Free; ComponentLink1URL: https://datasheet.ciiva.com/26945/getdatasheetpartid-788439-26945782.pdf?src-supplier=Verical; ComponentLink1Description: https://datasheet.ciiva.com/26945/getdatasheetpartid-788439-26945782.pdf?src-supplier=Verical; ComponentLink2URL: https://datasheet.ciiva.com/1634/60838-1634401.pdf?src-supplier=Farnell; ComponentLink2Description: https://datasheet.ciiva.com/1634/60838-1634401.pdf?src-supplier=Farnell; ComponentLink3URL: https://datasheet.ciiva.com/16861/70176037-16861125.pdf?src-supplier=Allied+Electronics; ComponentLink3Description: https://datasheet.ciiva.com/16861/70176037-16861125.pdf?src-supplier=Allied+Electronics; ComponentLink4URL: https://datasheet.ciiva.com/2900/b3u-1110-2900041.pdf?src-supplier=Digi-Key; ComponentLink4Description: https://datasheet.ciiva.com/2900/b3u-1110-2900041.pdf?src-supplier=Digi-Key; ComponentLink5URL: https://datasheet.ciiva.com/2900/b3u-1110-2900042.pdf?src-supplier=Digi-Key; ComponentLink5Description: https://datasheet.ciiva.com/2900/b3u-1110-2900042.pdf?src-supplier=Digi-Key; ComponentLink6URL: https://datasheet.ciiva.com/1532/60838-1532683.pdf?src-supplier=Element14; ComponentLink6Description: https://datasheet.ciiva.com/1532/60838-1532683.pdf?src-supplier=Element14; ComponentLink7URL: https://datasheet.ciiva.com/22696/60838-22696215.pdf?src-supplier=Element14; ComponentLink7Description: https://datasheet.ciiva.com/22696/60838-22696215.pdf?src-supplier=Element14; ComponentLink8URL: https://datasheet.ciiva.com/2900/b3u-1110-2900043.pdf?src-supplier=Digi-Key; ComponentLink8Description: https://datasheet.ciiva.com/2900/b3u-1110-2900043.pdf?src-supplier=Digi-Key; ComponentLink9URL: https://datasheet.ciiva.com/30119/en-b3u-30119821.pdf?src-supplier=Onlinecomponents.com; ComponentLink9Description: https://datasheet.ciiva.com/30119/en-b3u-30119821.pdf?src-supplier=Onlinecomponents.com
S2 = B3U-1000P: OMRON ELECTRONIC COMPONENTS         B3U-1000P            SWITCH, SPST-NO, 0.05A, 12V, SMD; Mechanical Life: 200000Cycles; Operating Force: 1.5N; Throw Configuration: SPST; Current Rating: 50mA; Contact Resistance: 100mR; Illumination Type: Non-Illuminated,Illuminated; Switch Travel: 0.15mm; Switch Function: Off-Mom; Actuator Type: Standard; Actuator Length: 0.4mm; Ratings: Dust Proof,IP40; Supplier 1: Digi-Key; Manufacturer: Omron; Manufacturer Part Number: B3U-1000P; Stock 1: 38234; Pricing 1: 1=0.84000, 10=0.80700, 25=0.76080, 50=0.66960, 100=0.60880, 250=0.57836, 500=0.56312, 1000=0.44137 (USD); RoHS: Yes; Mount: Surface Mount; Weight: 0.000776oz; Contact Material: Silver; Min Operating Temperature: -25°C; Max Operating Temperature: 70°C; Packaging: Tape and Reel; Voltage Rating (DC): 12V; Package Quantity: 1; Max Current Rating: 50mA; Termination: SMD/SMT; Orientation: Straight; Max Voltage Rating (DC): 12V; Electrical Life: 200000Cycles; Insulation Resistance: 100MR; Contact Current Rating: 50mA; Length: 4mm; Height: 1.2mm; Depth: 2.5mm; Width: 3mm; REACH SVHC: Unknown; Lead Free: Lead Free; ComponentLink1URL: https://datasheet.ciiva.com/26917/getdatasheetpartid-552554-26917552.pdf?src-supplier=Verical; ComponentLink1Description: https://datasheet.ciiva.com/26917/getdatasheetpartid-552554-26917552.pdf?src-supplier=Verical; ComponentLink2URL: https://datasheet.ciiva.com/22696/1685550-22696214.pdf?src-supplier=Element14; ComponentLink2Description: https://datasheet.ciiva.com/22696/1685550-22696214.pdf?src-supplier=Element14; ComponentLink3URL: https://datasheet.ciiva.com/1532/1685550-1532680.pdf?src-supplier=Element14; ComponentLink3Description: https://datasheet.ciiva.com/1532/1685550-1532680.pdf?src-supplier=Element14; ComponentLink4URL: https://datasheet.ciiva.com/1634/1685550-1634396.pdf?src-supplier=Farnell; ComponentLink4Description: https://datasheet.ciiva.com/1634/1685550-1634396.pdf?src-supplier=Farnell; ComponentLink5URL: https://datasheet.ciiva.com/14142/b3u-eng-datasheet-14142540.pdf?src-supplier=Distrelec; ComponentLink5Description: https://datasheet.ciiva.com/14142/b3u-eng-datasheet-14142540.pdf?src-supplier=Distrelec; ComponentLink6URL: https://datasheet.ciiva.com/2900/b3u-1110-2900029.pdf?src-supplier=Digi-Key; ComponentLink6Description: https://datasheet.ciiva.com/2900/b3u-1110-2900029.pdf?src-supplier=Digi-Key; ComponentLink7URL: https://datasheet.ciiva.com/16155/en-b3u-16155021.pdf?src-supplier=Onlinecomponents.com; ComponentLink7Description: https://datasheet.ciiva.com/16155/en-b3u-16155021.pdf?src-supplier=Onlinecomponents.com; ComponentLink8URL: https://datasheet.ciiva.com/2900/b3u-1110-2900030.pdf?src-supplier=Digi-Key; ComponentLink8Description: https://datasheet.ciiva.com/2900/b3u-1110-2900030.pdf?src-supplier=Digi-Key; ComponentLink9URL: https://datasheet.ciiva.com/16862/70176037-16862846.pdf?src-supplier=Allied+Electronics; ComponentLink9Description: https://datasheet.ciiva.com/16862/70176037-16862846.pdf?src-supplier=Allied+Electronics; ComponentLink10URL: https://datasheet.ciiva.com/2900/b3u-1110-2900031.pdf?src-supplier=Digi-Key; ComponentLink10Description: https://datasheet.ciiva.com/2900/b3u-1110-2900031.pdf?src-supplier=Digi-Key
TP6 TP7 = Test Point: General purpose test point
U1 = BQ24292IRGER: IC LI+ CHARGER PWR MGMT 24VQFN; Manufacturer: Texas Instruments; Interface: I2C; Min Supply Voltage: 3.9V; Max Supply Voltage: 17V; Output Current: 4.5A; Output Voltage: 4.4V; Switching Frequency: 1.5MHz; Number of Cells: 1; Operating Supply Current: 3A; Fault Protection: Over Current,Over Voltage,Over Temperature; Supplier 1: Digi-Key; Manufacturer Part Number: BQ24292IRGER; RoHS: Yes; Category: Battery Management; Stock 1: 2820; Pricing 1: 1=5.71000, 10=5.13100, 25=4.85120, 100=3.98860, 250=3.57896, 500=3.44960, 1000=2.86748 (USD); Mount: Surface Mount; Case/Package: VQFN; Number of Pins: 24; Contact Plating: Gold; Min Operating Temperature: -40°C; Max Operating Temperature: 85°C; Package Quantity: 3000; Packaging: Tape and Reel; Max Charge Current: 4.5A; Battery Pack Voltage: 4.4V; Lead Free: Lead Free; ComponentLink1URL: https://datasheet.ciiva.com/18617/bq24292i-18617578.pdf?src-supplier=Digi-Key; ComponentLink1Description: https://datasheet.ciiva.com/18617/bq24292i-18617578.pdf?src-supplier=Digi-Key
U2 U3 U5 U7 = TPS62130ARGTR: Conv DC-DC Single Step Down 3V to 17V 16-Pin QFN T/R; Manufacturer: Texas Instruments; Output Voltage: 6V; Output Current: 3A; Quiescent Current: 17uA; Output Type: Adjustable; Output Configuration: Positive; Number of Outputs: 1; Switching Frequency: 2.5MHz; Synchronous Rectifier: Yes; Min Output Voltage: 900mV; Supplier 1: Digi-Key; Manufacturer Part Number: TPS62130ARGTR; RoHS: Yes; Category: Power Supply Modules; Stock 1: 19781; Pricing 1: 1=2.08000, 10=1.86600, 25=1.76000, 100=1.40800, 250=1.23200, 500=1.19680, 1000=0.95040 (USD); Mount: Surface Mount; Case/Package: QFN; Number of Pins: 16; Contact Plating: Gold; Min Operating Temperature: -40°C; Max Operating Temperature: 125°C; Operating Supply Voltage: 17V; Package Quantity: 3000; Packaging: Tape and Reel; Max Input Voltage: 17V; Min Input Voltage: 3V; Min Supply Voltage: 3V; Max Output Current: 3A; Max Output Voltage: 6V; Radiation Hardening: No; Lead Free: Lead Free; REACH SVHC: No SVHC; ComponentLink1URL: https://datasheet.ciiva.com/14377/tps62130-14377120.pdf?src-supplier=Digi-Key; ComponentLink1Description: https://datasheet.ciiva.com/14377/tps62130-14377120.pdf?src-supplier=Digi-Key; ComponentLink2URL: https://datasheet.ciiva.com/46638/tps62130a-46638750.pdf?src-supplier=Digi-Key; ComponentLink2Description: https://datasheet.ciiva.com/46638/tps62130a-46638750.pdf?src-supplier=Digi-Key; ComponentLink3URL: https://datasheet.ciiva.com/30031/tps62130-30031567.pdf?src-supplier=Avnet; ComponentLink3Description: https://datasheet.ciiva.com/30031/tps62130-30031567.pdf?src-supplier=Avnet
U4 = MAX17048G+T10: IC FUEL GAUGE LI-ION 1CELL 8TDFN; Manufacturer: Maxim; Operating Supply Current: 23uA; Output Voltage: 400mV; Operating Supply Voltage: 4.5V; Supplier 1: Digi-Key; Manufacturer Part Number: MAX17048G+T10; RoHS: Yes; Category: Battery Management; Stock 1: 3057; Pricing 1: 1=2.14000, 10=1.92300, 25=1.81800, 100=1.49480, 250=1.34128, 500=1.31300 (USD); Mount: Surface Mount; Number of Pins: 8; Contact Plating: Tin,Matte; Min Operating Temperature: -20°C; Max Operating Temperature: 85°C; Packaging: Tape and Reel; Package Quantity: 10000; Radiation Hardening: No; ComponentLink1URL: https://datasheet.ciiva.com/14083/max17048-max17049-14083973.pdf?src-supplier=Digi-Key; ComponentLink1Description: https://datasheet.ciiva.com/14083/max17048-max17049-14083973.pdf?src-supplier=Digi-Key
U6 = STM32G431KBU6: MCU 32-Bit ARM Cortex-M4 RISC 128KB Flash 1.71V to 3.6V 32-Pin UFQFPN; Manufacturer: STMicroelectronics; Supplier 1: Digi-Key; Manufacturer Part Number: STM32G431KBU6; RoHS: No; Stock 1: 2759; Pricing 1: 1=4.44000, 10=3.99100, 25=3.77320, 100=3.27000, 250=3.10228, 500=2.78366, 1000=2.34766, 2500=2.23028, 5000=2.14643 (USD)
U8 = TPS61232DRCR: IC REG BOOST 5V 4A 10VSON; Manufacturer: Texas Instruments; Output Type: Fixed; Number of Outputs: 1; Switching Frequency: 2MHz; Min Input Voltage: 2.3V; Efficiency: 96%; Max Output Current: 2.1A; Max Input Voltage: 5.5V; Quiescent Current: 35uA; Supplier 1: Digi-Key; Manufacturer Part Number: TPS61232DRCR; RoHS: Yes; Category: Power Supply Modules; Stock 1: 1050; Pricing 1: 1=2.47000, 10=2.21500, 25=2.09000, 100=1.67200, 250=1.46300, 500=1.42120, 1000=1.12860 (USD); Mount: Surface Mount; Number of Pins: 10; Contact Plating: Gold; Min Operating Temperature: -40°C; Max Operating Temperature: 85°C; Output Voltage: 5V; Topology: Boost; Operating Supply Voltage: 5.5V; Lead Free: Lead Free; ComponentLink1URL: http://www.ti.com/lit/ds/symlink/tps61232.pdf?src-supplier=Digi-Key; ComponentLink1Description: http://www.ti.com/lit/ds/symlink/tps61232.pdf?src-supplier=Digi-Key; ComponentLink2URL: http://www.ti.com/general/docs/suppproductinfo.tsp?distId=10&amp;gotoUrl=http%3A%2F%2Fwww.ti.com%2Flit%2Fgpn%2Ftps61232&src-supplier=Digi-Key; ComponentLink2Description: http://www.ti.com/general/docs/suppproductinfo.tsp?distId=10&amp;gotoUrl=http%3A%2F%2Fwww.ti.com%2Flit%2Fgpn%2Ftps61232&src-supplier=Digi-Key
U9 = TLV75533PDBVR: IC REG LINEAR 3.3V 500MA SOT23-5; Manufacturer: Texas Instruments; Supplier 1: Digi-Key; Manufacturer Part Number: TLV75533PDBVR; Stock 1: 25120; Pricing 1: 1=0.63000, 10=0.55100, 100=0.39250, 500=0.31730, 1000=0.24215 (USD); RoHS: No; Min Operating Temperature: -40°C; Max Operating Temperature: 125°C; ComponentLink1URL: http://www.ti.com/lit/ds/symlink/tlv755p.pdf?src-supplier=Digi-Key; ComponentLink1Description: http://www.ti.com/lit/ds/symlink/tlv755p.pdf?src-supplier=Digi-Key